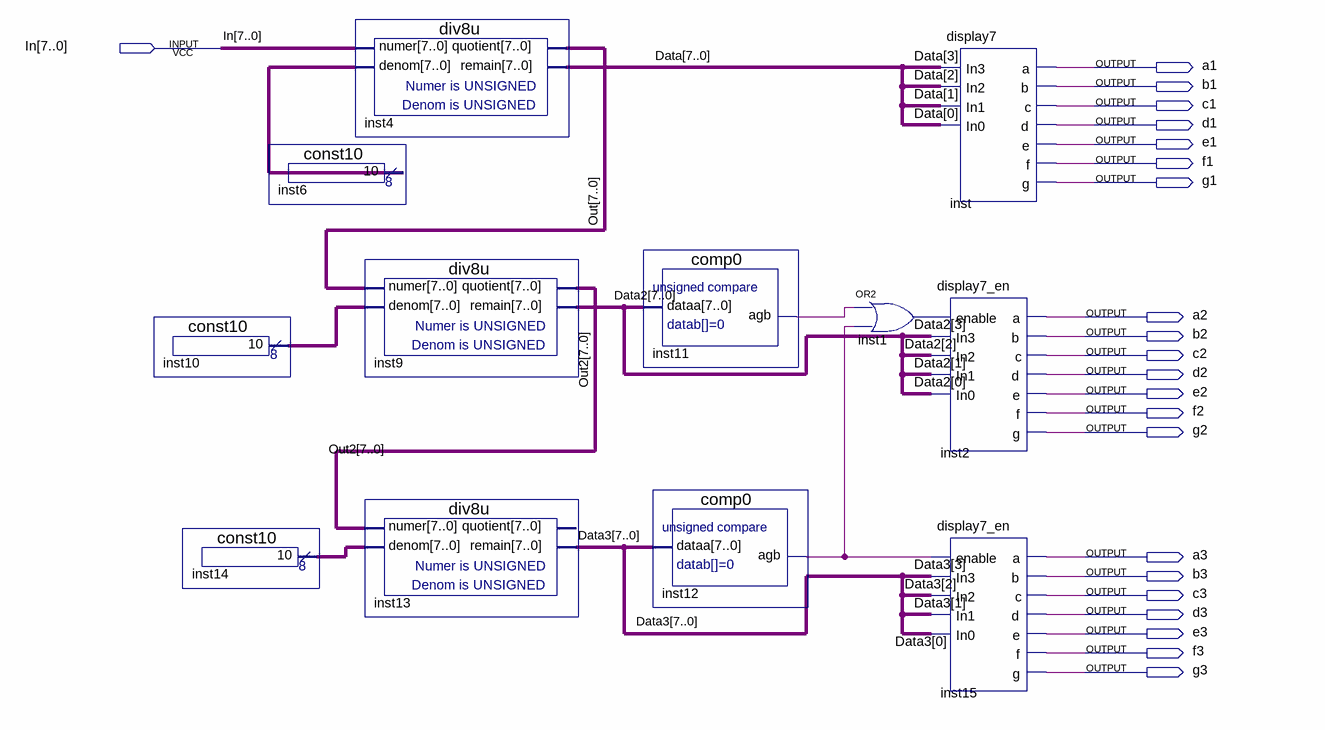
[diagram p0: schematic sheet]
// Quartus schematic display_8bits.bdf as structural Verilog: 12 symbols, 22 pins
module display_8bits (
  input  [7:0] In,
  output a1,
  output b1,
  output c1,
  output d1,
  output e1,
  output f1,
  output g1,
  output a2,
  output b2,
  output c2,
  output d2,
  output e2,
  output f2,
  output g2,
  output a3,
  output b3,
  output c3,
  output d3,
  output e3,
  output f3,
  output g3
);

  wire inst1_out, inst11_agb, inst12_agb;
  wire [7:0] Data, Data2, Data3, inst6_result, inst10_result, inst14_result, Out, Out2;

  const10 inst10 (.result(inst10_result));
  const10 inst14 (.result(inst14_result));
  const10 inst6 (.result(inst6_result));
  div8u inst4 (.numer(In), .denom(inst6_result), .quotient(Out), .remain(Data));
  div8u inst9 (.numer(Out), .denom(inst10_result), .quotient(Out2), .remain(Data2));
  div8u inst13 (.numer(Out2), .denom(inst14_result), .remain(Data3));  // open: quotient
  comp0 inst11 (.dataa(Data2), .agb(inst11_agb));
  comp0 inst12 (.dataa(Data3), .agb(inst12_agb));
  or inst1 (inst1_out, inst11_agb, inst12_agb);
  display7 inst (
    .In3(Data[3]), .In2(Data[2]), .In1(Data[1]), .In0(Data[0]), .a(a1), .b(b1), .c(c1), .d(d1), .e(e1),
    .f(f1), .g(g1));
  display7_en inst2 (
    .enable(inst1_out), .In3(Data2[3]), .In2(Data2[2]), .In1(Data2[1]), .In0(Data2[0]), .a(a2), .b(b2),
    .c(c2), .d(d2), .e(e2), .f(f2), .g(g2));
  display7_en inst15 (
    .enable(inst12_agb), .In3(Data3[3]), .In2(Data3[2]), .In1(Data3[1]), .In0(Data3[0]), .a(a3), .b(b3),
    .c(c3), .d(d3), .e(e3), .f(f3), .g(g3));
endmodule
